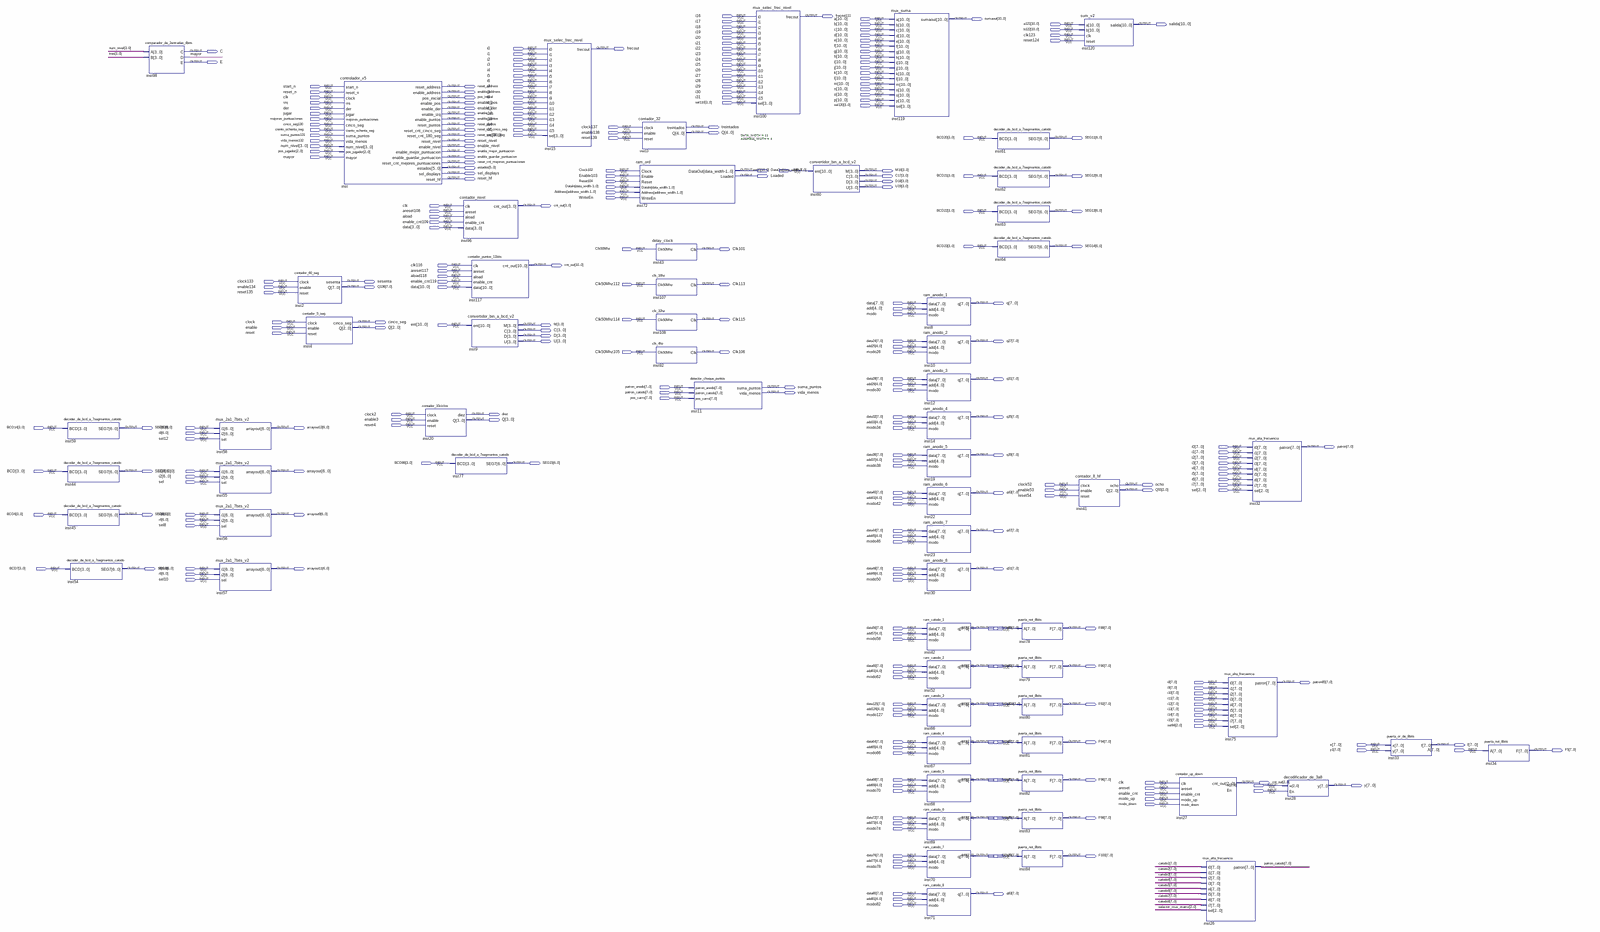
[diagram p0: schematic sheet, whole]
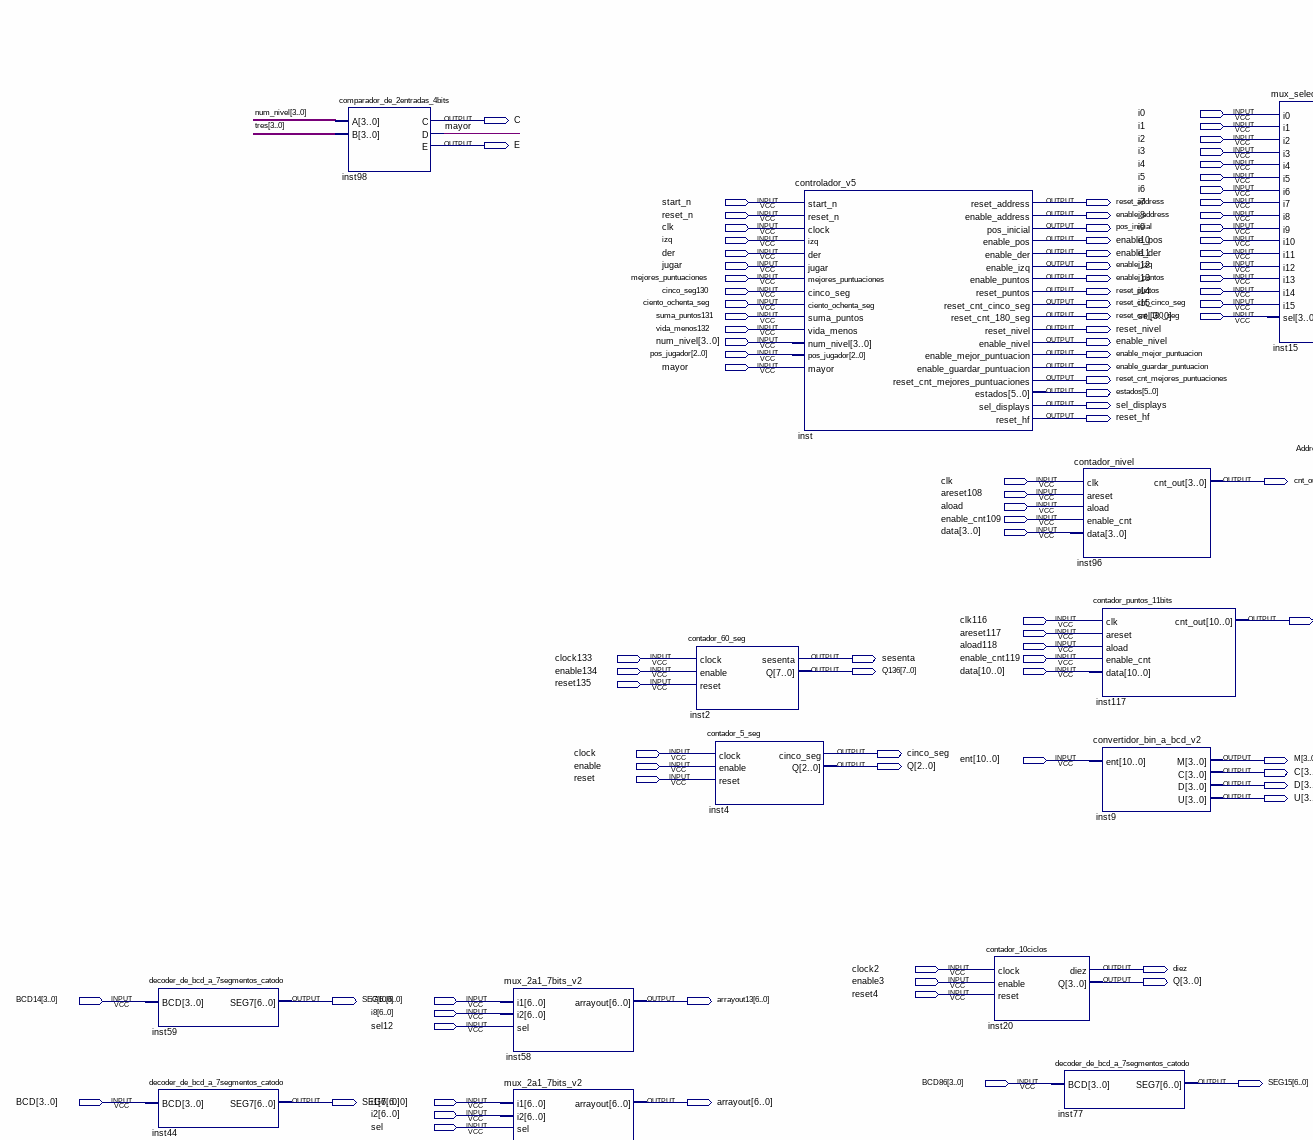
[diagram p1: schematic sheet, upper left part]
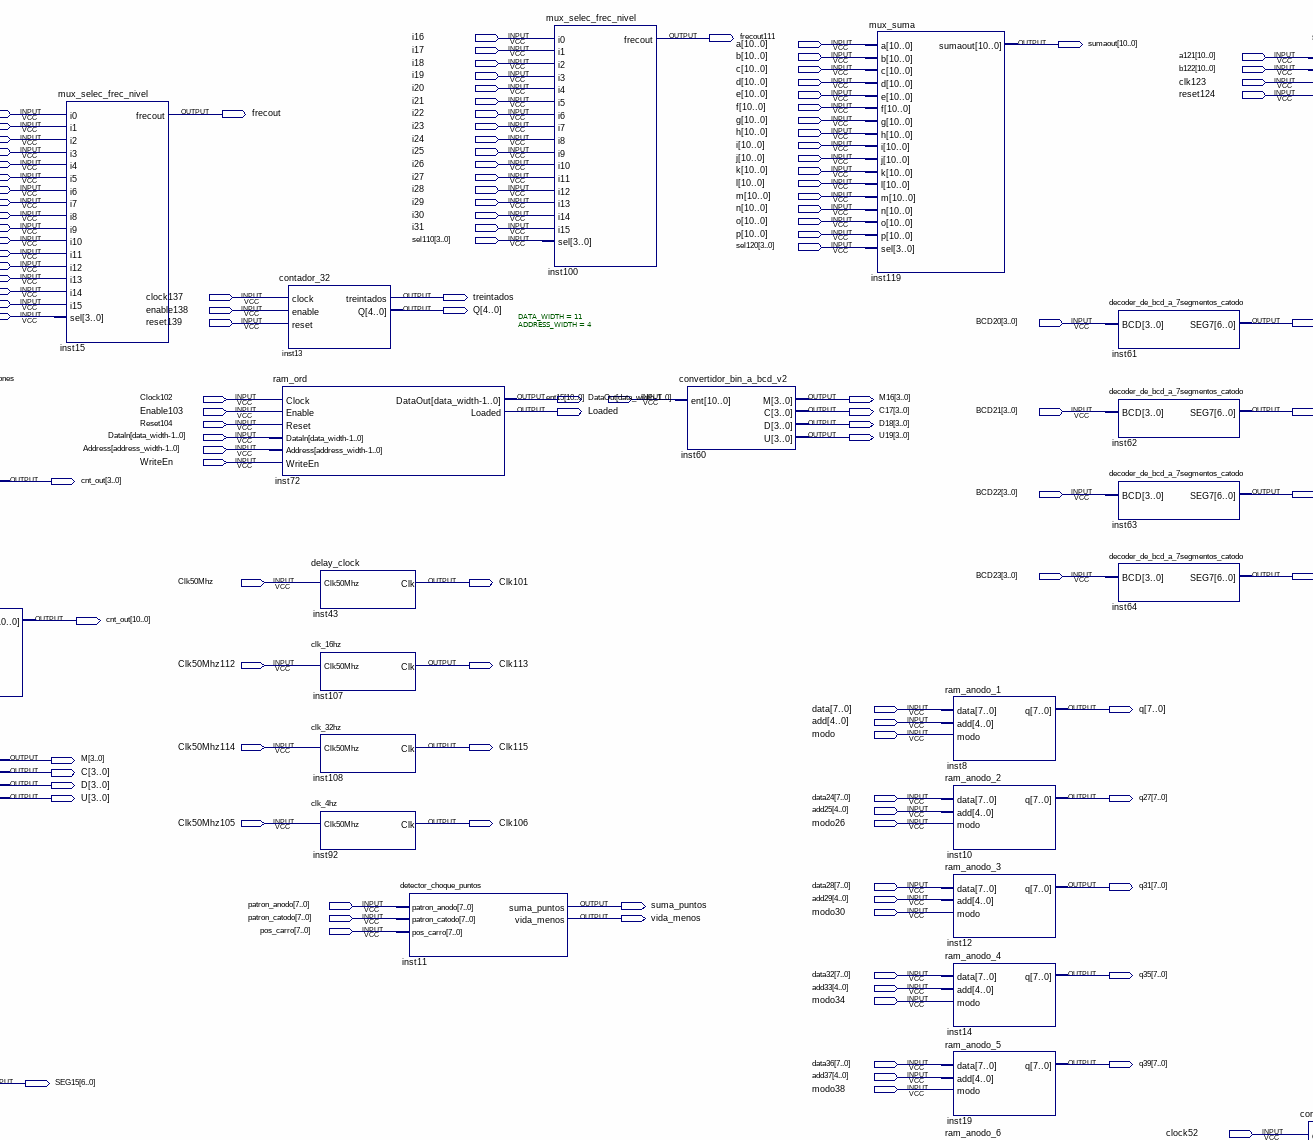
[diagram p2: schematic sheet, upper centre part]
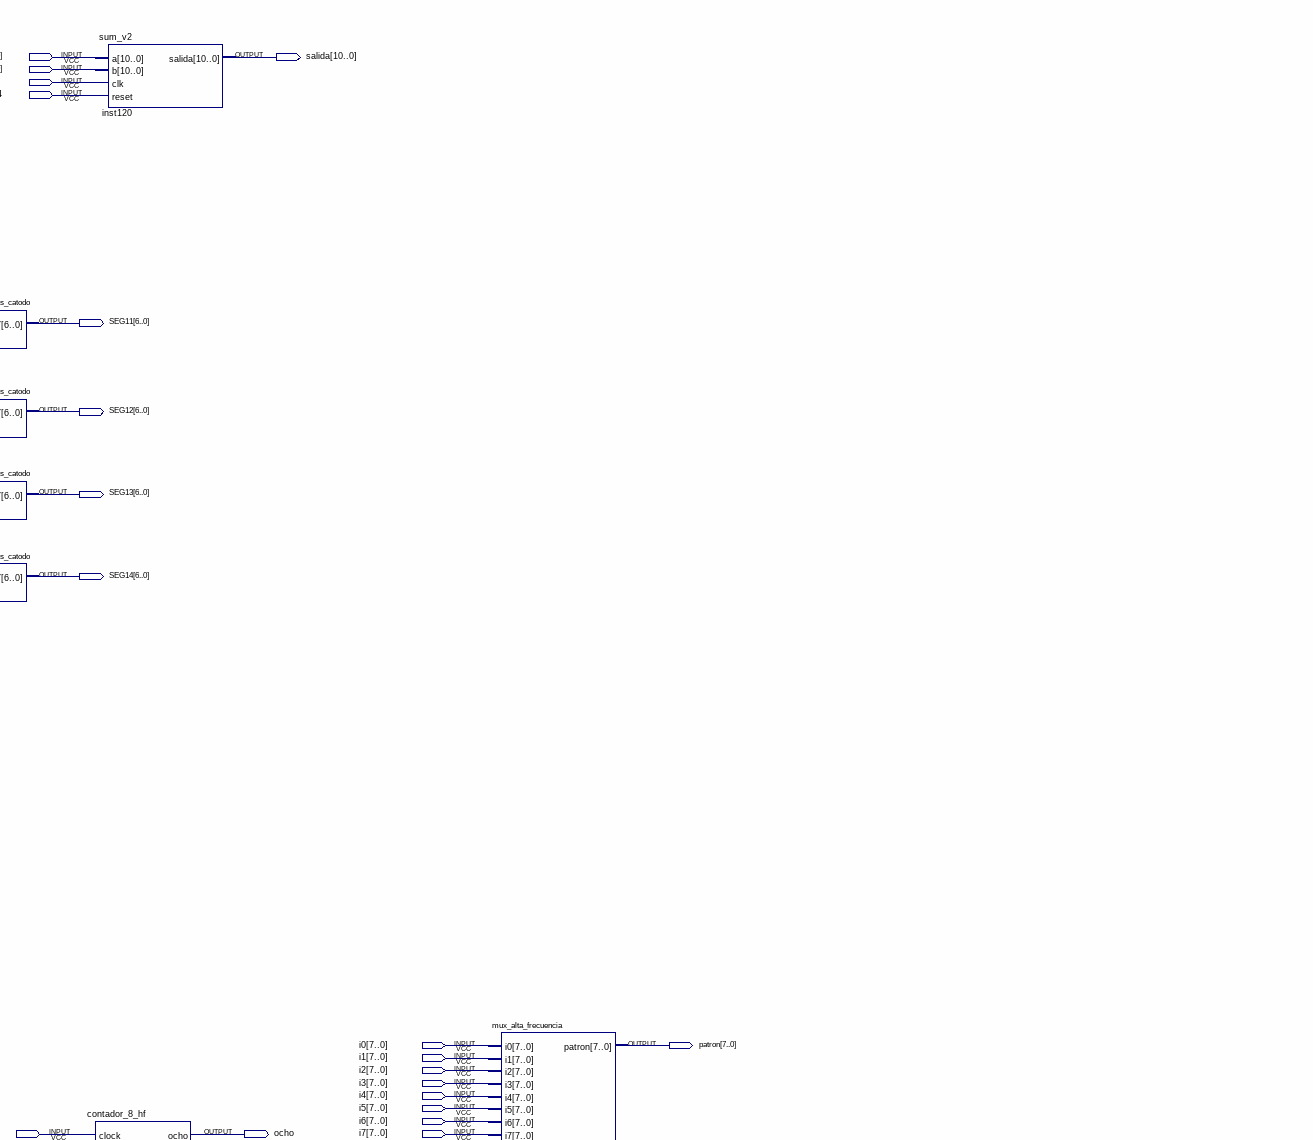
[diagram p3: schematic sheet, upper right part]
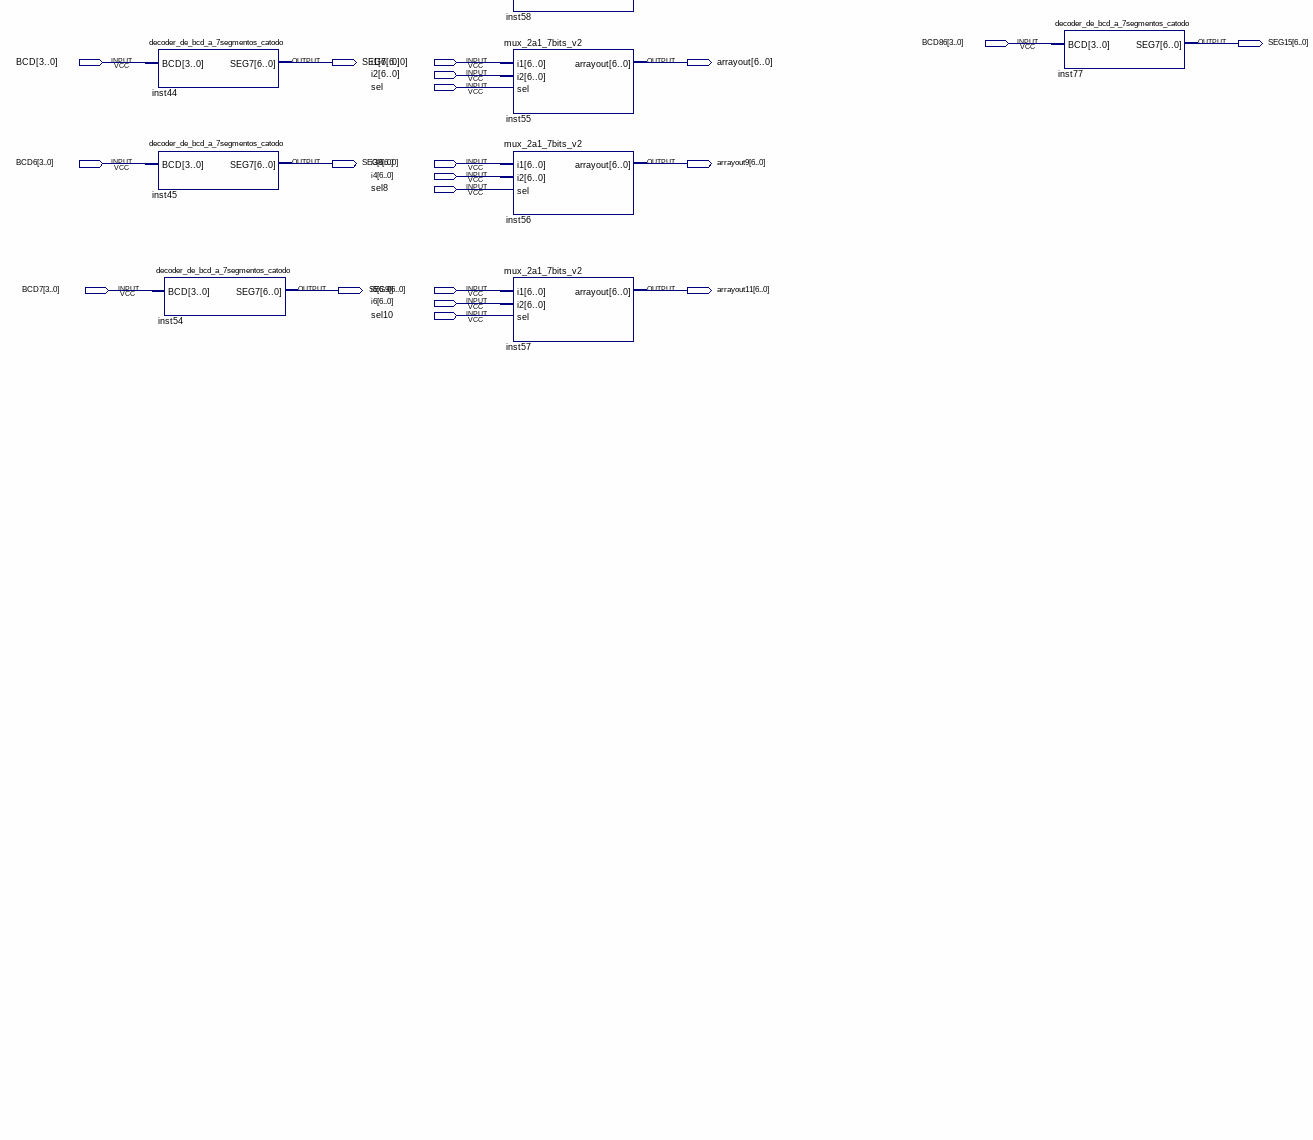
[diagram p4: schematic sheet, lower left part]
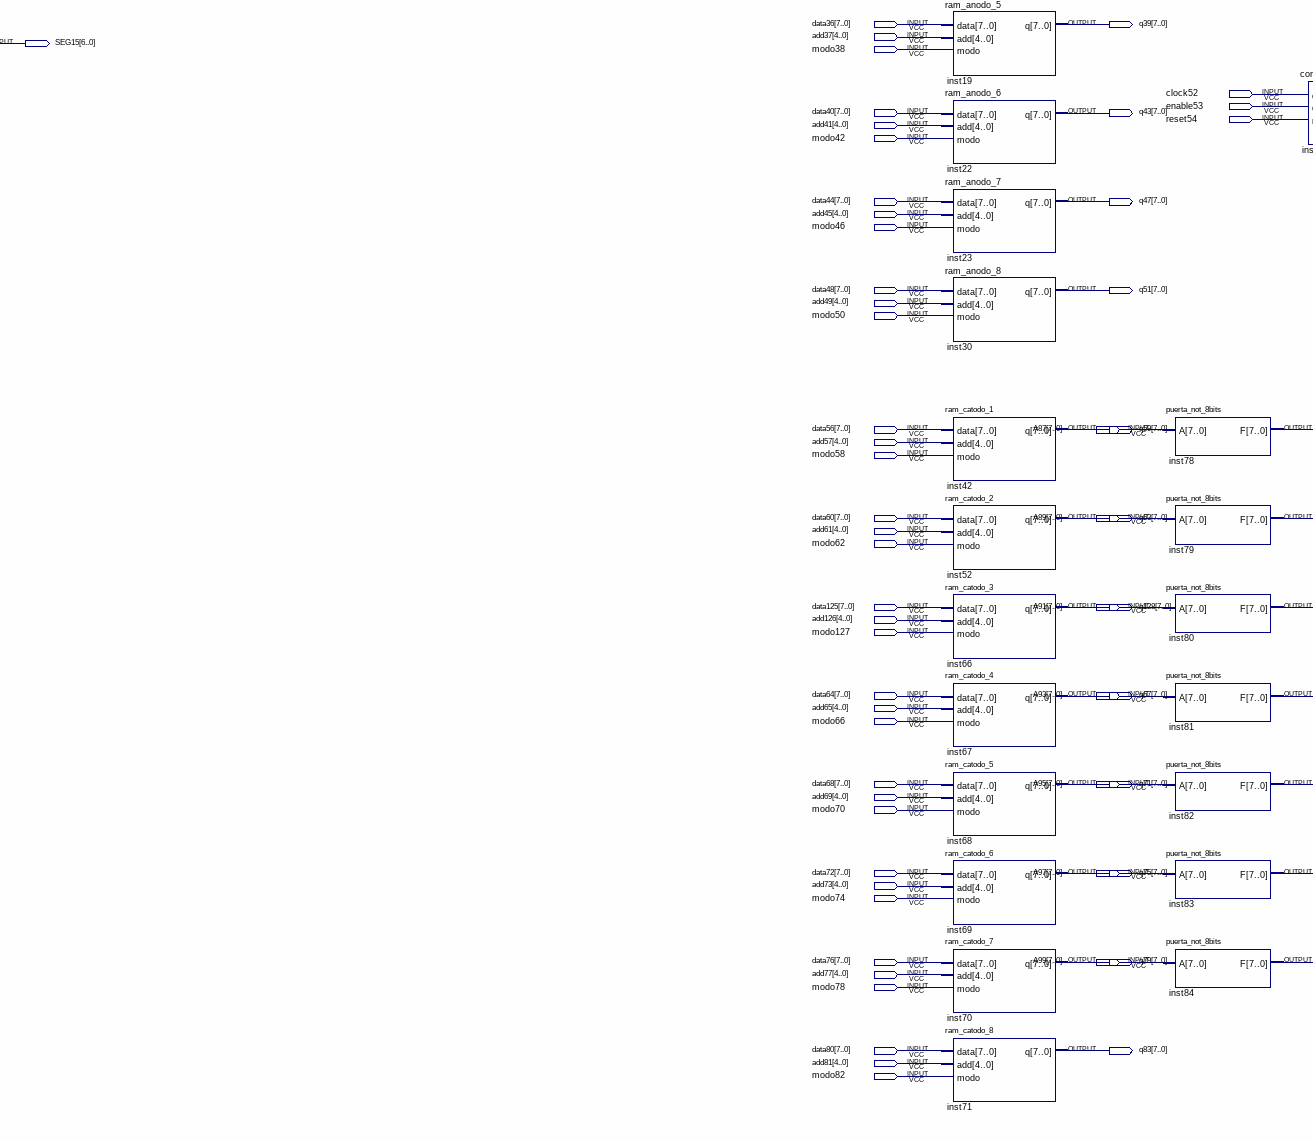
[diagram p5: schematic sheet, lower centre part]
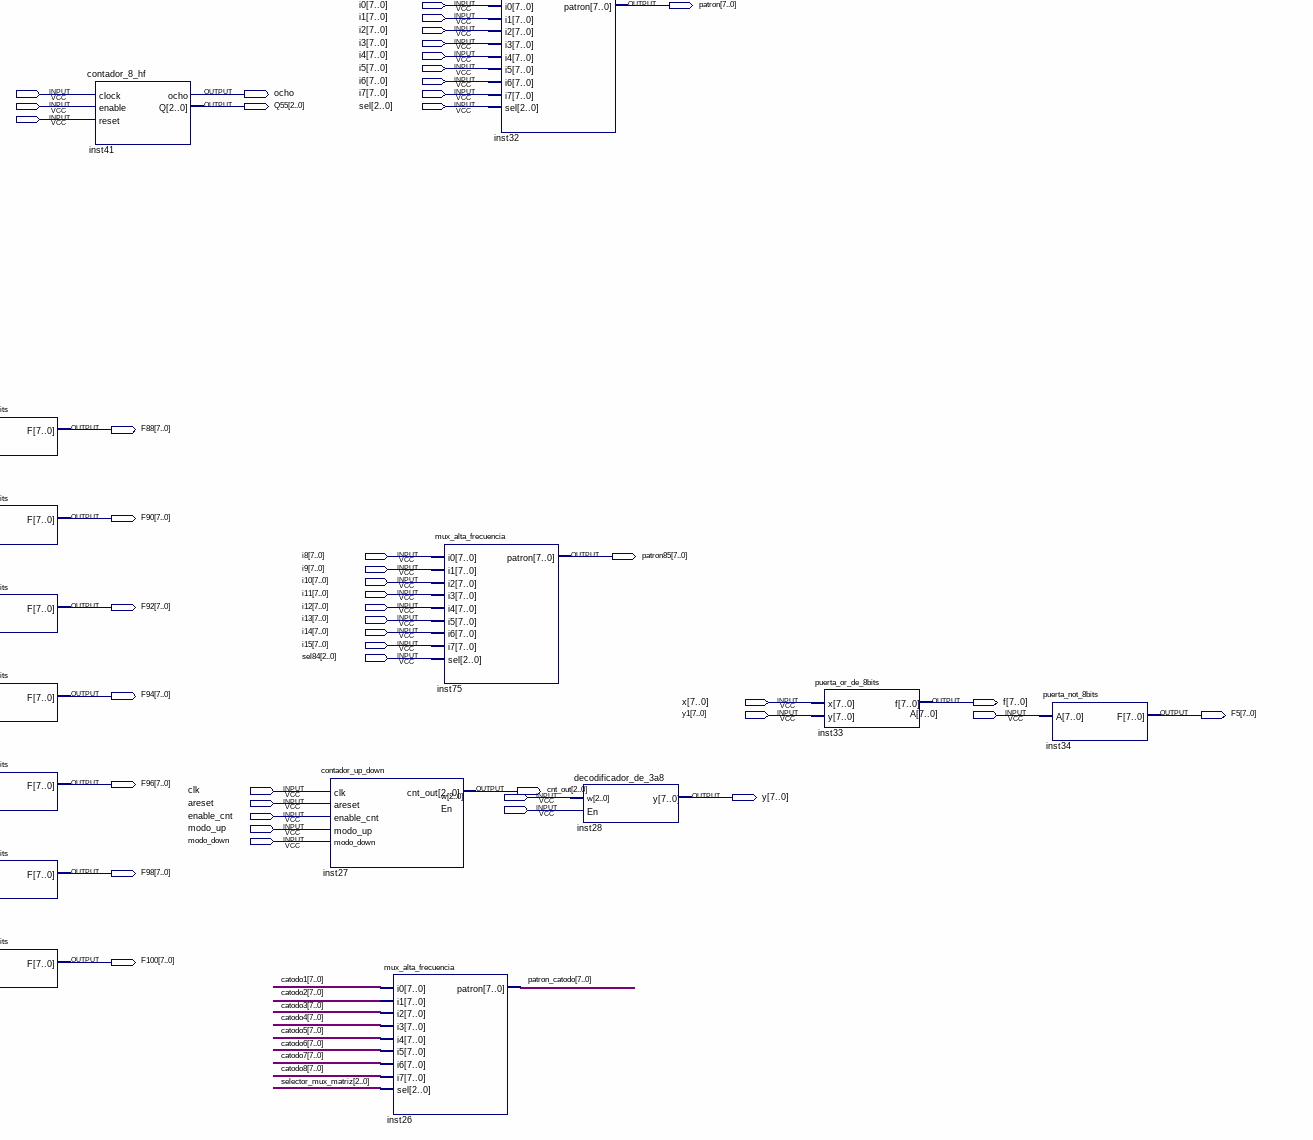
[diagram p6: schematic sheet, lower right part]
// Quartus schematic pruebas.bdf as structural Verilog: 64 symbols, 307 pins
module pruebas (
  input  i16,
  input  [10:0] A,
  input  i17,
  input  [10:0] b,
  input  [10:0] a121,
  input  i18,
  inout  [10:0] c,
  input  [10:0] b122,
  input  i19,
  inout  [10:0] d,
  input  clk123,
  input  i20,
  input  [10:0] e,
  input  reset124,
  input  i21,
  inout  [10:0] f,
  input  i0_1bit,
  input  i22,
  input  [10:0] g,
  input  i1_1bit,
  input  i23,
  input  [10:0] h,
  input  i2_1bit,
  input  i24,
  input  [10:0] i,
  input  i3_1bit,
  input  i25,
  input  [10:0] j,
  input  i4_1bit,
  input  i26,
  input  [10:0] k,
  input  i5_1bit,
  input  i27,
  input  [10:0] l,
  input  i6_1bit,
  input  i28,
  inout  [10:0] m,
  input  start_n,
  input  i7_1bit,
  input  i29,
  input  [10:0] n,
  input  reset_n,
  input  i8_1bit,
  input  i30,
  input  [10:0] o,
  input  clk,
  input  i9_1bit,
  input  i31,
  input  [10:0] p,
  input  izq,
  input  i10_1bit,
  input  [3:0] sel110,
  input  [3:0] sel120,
  input  der,
  input  i11_1bit,
  input  jugar,
  input  i12_1bit,
  input  mejores_puntuaciones,
  input  i13_1bit,
  input  cinco_seg130,
  input  i14_1bit,
  input  clock137,
  input  ciento_ochenta_seg,
  input  i15_1bit,
  input  enable138,
  input  suma_puntos131,
  input  [3:0] sel,
  input  reset139,
  input  [3:0] BCD20,
  input  vida_menos132,
  input  [3:0] num_nivel,
  input  [2:0] pos_jugador,
  input  mayor,
  input  Clock102,
  input  [10:0] ent15,
  input  Enable103,
  input  [3:0] BCD21,
  input  Reset104,
  input  \DataIn[data_width-1..0] ,
  input  \Address[address_width-1..0] ,
  input  WriteEn,
  input  areset108,
  input  [3:0] BCD22,
  input  aload,
  input  enable_cnt109,
  input  [10:0] data,
  input  [3:0] BCD23,
  input  Clk50Mhz,
  input  clk116,
  input  areset117,
  input  aload118,
  input  clock133,
  input  enable_cnt119,
  input  Clk50Mhz112,
  input  enable134,
  input  reset135,
  input  [4:0] add,
  input  modo,
  input  Clk50Mhz114,
  input  clock,
  input  [10:0] ent,
  input  enable,
  input  reset,
  input  [7:0] data24,
  input  [4:0] add25,
  input  Clk50Mhz105,
  input  modo26,
  input  [7:0] data28,
  input  [4:0] add29,
  input  [7:0] patron_anodo,
  input  modo30,
  input  [7:0] patron_catodo,
  input  [7:0] pos_carro,
  input  clock2,
  input  [7:0] data32,
  input  enable3,
  input  [4:0] add33,
  input  reset4,
  input  [3:0] BCD14,
  input  [7:0] i7,
  input  modo34,
  input  [7:0] i8,
  input  sel12,
  input  [7:0] i0,
  input  [7:0] i1,
  input  [7:0] data36,
  input  [7:0] i2,
  input  [4:0] add37,
  input  [3:0] BCD86,
  input  [7:0] i3,
  input  modo38,
  input  [7:0] i4,
  input  [3:0] BCD,
  input  [7:0] i5,
  input  [7:0] i6,
  input  sel_1bit,
  input  clock52,
  input  enable53,
  input  [7:0] data40,
  input  reset54,
  input  [4:0] add41,
  input  modo42,
  input  [3:0] BCD6,
  input  sel8,
  input  [7:0] data44,
  input  [4:0] add45,
  input  modo46,
  input  [3:0] BCD7,
  input  [7:0] data48,
  input  [4:0] add49,
  input  sel10,
  input  modo50,
  input  [7:0] data56,
  input  [7:0] A87,
  input  [4:0] add57,
  input  modo58,
  input  [7:0] data60,
  input  [7:0] A89,
  input  [4:0] add61,
  input  modo62,
  input  [7:0] i9,
  input  [7:0] i10,
  input  [7:0] i11,
  input  [7:0] data125,
  input  [7:0] A91,
  input  [7:0] i12,
  input  [4:0] add126,
  input  [7:0] i13,
  input  modo127,
  input  [7:0] i14,
  input  [7:0] i15,
  input  [2:0] sel84,
  input  [7:0] data64,
  input  [7:0] A93,
  input  [7:0] x,
  input  [4:0] add65,
  input  [7:0] y1,
  input  modo66,
  input  [7:0] data68,
  input  [7:0] A95,
  input  [4:0] add69,
  input  [2:0] w,
  input  areset,
  input  modo70,
  input  En,
  input  enable_cnt,
  input  modo_up,
  input  modo_down,
  input  [7:0] data72,
  input  [7:0] A97,
  input  [4:0] add73,
  input  modo74,
  input  [7:0] data76,
  input  [7:0] A99,
  input  [4:0] add77,
  input  modo78,
  input  [7:0] data80,
  input  [4:0] add81,
  input  modo82,
  output frecout111,
  output [10:0] sumaout,
  output [10:0] salida,
  output frecout,
  output c_1bit,
  output e_1bit,
  output reset_address,
  output enable_address,
  output pos_inicial,
  output enable_pos,
  output enable_der,
  output enable_izq,
  output enable_puntos,
  output reset_puntos,
  output treintados,
  output reset_cnt_cinco_seg,
  output [7:0] Q,
  output reset_cnt_180_seg,
  output [6:0] SEG11,
  output reset_nivel,
  output enable_nivel,
  output enable_mejor_puntuacion,
  output enable_guardar_puntuacion,
  output reset_cnt_mejores_puntuaciones,
  output [5:0] estados,
  output \DataOut[data_width-1..0] ,
  output [3:0] M16,
  output sel_displays,
  output Loaded,
  output [3:0] C17,
  output [6:0] SEG12,
  output reset_hf,
  output [3:0] D18,
  output [3:0] U19,
  output [10:0] cnt_out,
  output [6:0] SEG13,
  output [6:0] SEG14,
  output Clk101,
  output sesenta,
  output Clk113,
  output [7:0] Q136,
  output Clk115,
  output cinco_seg,
  output [3:0] U,
  output [7:0] q27,
  output Clk106,
  output [7:0] q31,
  output suma_puntos,
  output vida_menos,
  output diez,
  output [7:0] q35,
  output [6:0] SEG10,
  output [6:0] arrayout13,
  output [7:0] patron,
  output [7:0] q39,
  output [6:0] SEG15,
  output [6:0] SEG7,
  output [6:0] arrayout,
  output ocho,
  output [2:0] Q55,
  output [7:0] q43,
  output [6:0] SEG8,
  output [6:0] arrayout9,
  output [7:0] q47,
  output [6:0] SEG9,
  output [6:0] arrayout11,
  output [7:0] q51,
  output [7:0] q59,
  output [7:0] F88,
  output [7:0] q63,
  output [7:0] F90,
  output [7:0] patron85,
  output [7:0] q128,
  output [7:0] F92,
  output [7:0] q67,
  output [7:0] F94,
  output [7:0] F5,
  output [7:0] q71,
  output [7:0] F96,
  output [7:0] y,
  output [7:0] q75,
  output [7:0] F98,
  output [7:0] q79,
  output [7:0] F100,
  output [7:0] q83
);

  wire [2:0] selector_mux_matriz;
  wire [3:0] tres;
  wire [7:0] catodo1, catodo2, catodo3, catodo4, catodo5, catodo6, catodo7, catodo8;

  decoder_de_bcd_a_7segmentos_catodo inst59 (.BCD(BCD14), .SEG7(SEG10));
  decoder_de_bcd_a_7segmentos_catodo inst44 (.BCD(BCD), .SEG7(SEG7));
  decoder_de_bcd_a_7segmentos_catodo inst45 (.BCD(BCD6), .SEG7(SEG8));
  decoder_de_bcd_a_7segmentos_catodo inst54 (.BCD(BCD7), .SEG7(SEG9));
  comparador_de_2entradas_4bits inst98 (.A(num_nivel), .B(tres), .C(c_1bit), .D(mayor), .E(e_1bit));
  mux_2a1_7bits_v2 inst58 (.i1(i7[6:0]), .i2(i8[6:0]), .sel(sel12), .arrayout(arrayout13));
  mux_2a1_7bits_v2 inst55 (.i1(i1[6:0]), .i2(i2[6:0]), .sel(sel_1bit), .arrayout(arrayout));
  mux_2a1_7bits_v2 inst56 (.i1(i3[6:0]), .i2(i4[6:0]), .sel(sel8), .arrayout(arrayout9));
  mux_2a1_7bits_v2 inst57 (.i1(i5[6:0]), .i2(i6[6:0]), .sel(sel10), .arrayout(arrayout11));
  contador_60_seg inst2 (.clock(clock133), .enable(enable134), .reset(reset135), .sesenta(sesenta), .Q(Q136));
  contador_5_seg inst4 (.clock(clock), .enable(enable), .reset(reset), .cinco_seg(cinco_seg), .Q(Q[2:0]));
  controlador_v5 inst (
    .start_n(start_n), .reset_n(reset_n), .clock(clk), .izq(izq), .der(der), .jugar(jugar),
    .mejores_puntuaciones(mejores_puntuaciones), .cinco_seg(cinco_seg130),
    .ciento_ochenta_seg(ciento_ochenta_seg), .suma_puntos(suma_puntos131), .vida_menos(vida_menos132),
    .num_nivel(num_nivel), .pos_jugador(pos_jugador), .mayor(mayor), .reset_address(reset_address),
    .enable_address(enable_address), .pos_inicial(pos_inicial), .enable_pos(enable_pos),
    .enable_der(enable_der), .enable_izq(enable_izq), .enable_puntos(enable_puntos),
    .reset_puntos(reset_puntos), .reset_cnt_cinco_seg(reset_cnt_cinco_seg),
    .reset_cnt_180_seg(reset_cnt_180_seg), .reset_nivel(reset_nivel), .enable_nivel(enable_nivel),
    .enable_mejor_puntuacion(enable_mejor_puntuacion), .enable_guardar_puntuacion(enable_guardar_puntuacion),
    .reset_cnt_mejores_puntuaciones(reset_cnt_mejores_puntuaciones), .estados(estados),
    .sel_displays(sel_displays), .reset_hf(reset_hf));
  contador_10ciclos inst20 (.clock(clock2), .enable(enable3), .reset(reset4), .diez(diez), .Q(Q[3:0]));
  contador_nivel inst96 (
    .clk(clk), .areset(areset108), .aload(aload), .enable_cnt(enable_cnt109), .data(data[3:0]),
    .cnt_out(cnt_out[3:0]));
  contador_puntos_11bits inst117 (
    .clk(clk116), .areset(areset117), .aload(aload118), .enable_cnt(enable_cnt119), .data(data),
    .cnt_out(cnt_out));
  convertidor_bin_a_bcd_v2 inst9 (.ent(ent), .M(m[3:0]), .C(c[3:0]), .D(d[3:0]), .U(U));
  decoder_de_bcd_a_7segmentos_catodo inst77 (.BCD(BCD86), .SEG7(SEG15));
  mux_selec_frec_nivel inst15 (
    .i0(i0_1bit), .i1(i1_1bit), .i2(i2_1bit), .i3(i3_1bit), .i4(i4_1bit), .i5(i5_1bit), .i6(i6_1bit),
    .i7(i7_1bit), .i8(i8_1bit), .i9(i9_1bit), .i10(i10_1bit), .i11(i11_1bit), .i12(i12_1bit), .i13(i13_1bit),
    .i14(i14_1bit), .i15(i15_1bit), .sel(sel), .frecout(frecout));
  contador_32 inst13 (.clock(clock137), .enable(enable138), .reset(reset139), .treintados(treintados), .Q(Q[4:0]));
  ram_ord #(.DATA_WIDTH(11), .ADDRESS_WIDTH(4)) inst72 (
    .Clock(Clock102), .Enable(Enable103), .Reset(Reset104), .DataIn({11{\DataIn[data_width-1..0] }}),
    .Address({4{\Address[address_width-1..0] }}), .WriteEn(WriteEn), .DataOut(\DataOut[data_width-1..0] ),
    .Loaded(Loaded));
  delay_clock inst43 (.Clk50Mhz(Clk50Mhz), .Clk(Clk101));
  clk_16hz inst107 (.Clk50Mhz(Clk50Mhz112), .Clk(Clk113));
  clk_32hz inst108 (.Clk50Mhz(Clk50Mhz114), .Clk(Clk115));
  clk_4hz inst92 (.Clk50Mhz(Clk50Mhz105), .Clk(Clk106));
  detector_choque_puntos inst11 (
    .patron_anodo(patron_anodo), .patron_catodo(patron_catodo), .pos_carro(pos_carro),
    .suma_puntos(suma_puntos), .vida_menos(vida_menos));
  mux_selec_frec_nivel inst100 (
    .i0(i16), .i1(i17), .i2(i18), .i3(i19), .i4(i20), .i5(i21), .i6(i22), .i7(i23), .i8(i24), .i9(i25),
    .i10(i26), .i11(i27), .i12(i28), .i13(i29), .i14(i30), .i15(i31), .sel(sel110), .frecout(frecout111));
  convertidor_bin_a_bcd_v2 inst60 (.ent(ent15), .M(M16), .C(C17), .D(D18), .U(U19));
  mux_suma inst119 (
    .a(A), .b(b), .c(c), .d(d), .e(e), .f(f), .g(g), .h(h), .i(i), .j(j), .k(k), .l(l), .m(m), .n(n), .o(o),
    .p(p), .sel(sel120), .sumaout(sumaout));
  ram_anodo_1 inst8 (.data(data[7:0]), .add(add), .modo(modo), .q(Q));
  ram_anodo_2 inst10 (.data(data24), .add(add25), .modo(modo26), .q(q27));
  ram_anodo_3 inst12 (.data(data28), .add(add29), .modo(modo30), .q(q31));
  ram_anodo_4 inst14 (.data(data32), .add(add33), .modo(modo34), .q(q35));
  ram_anodo_5 inst19 (.data(data36), .add(add37), .modo(modo38), .q(q39));
  ram_anodo_6 inst22 (.data(data40), .add(add41), .modo(modo42), .q(q43));
  ram_anodo_7 inst23 (.data(data44), .add(add45), .modo(modo46), .q(q47));
  ram_anodo_8 inst30 (.data(data48), .add(add49), .modo(modo50), .q(q51));
  ram_catodo_1 inst42 (.data(data56), .add(add57), .modo(modo58), .q(q59));
  ram_catodo_2 inst52 (.data(data60), .add(add61), .modo(modo62), .q(q63));
  ram_catodo_3 inst66 (.data(data125), .add(add126), .modo(modo127), .q(q128));
  ram_catodo_4 inst67 (.data(data64), .add(add65), .modo(modo66), .q(q67));
  ram_catodo_5 inst68 (.data(data68), .add(add69), .modo(modo70), .q(q71));
  ram_catodo_6 inst69 (.data(data72), .add(add73), .modo(modo74), .q(q75));
  ram_catodo_7 inst70 (.data(data76), .add(add77), .modo(modo78), .q(q79));
  ram_catodo_8 inst71 (.data(data80), .add(add81), .modo(modo82), .q(q83));
  decoder_de_bcd_a_7segmentos_catodo inst61 (.BCD(BCD20), .SEG7(SEG11));
  decoder_de_bcd_a_7segmentos_catodo inst62 (.BCD(BCD21), .SEG7(SEG12));
  decoder_de_bcd_a_7segmentos_catodo inst63 (.BCD(BCD22), .SEG7(SEG13));
  decoder_de_bcd_a_7segmentos_catodo inst64 (.BCD(BCD23), .SEG7(SEG14));
  puerta_not_8bits inst78 (.A(A87), .F(F88));
  puerta_not_8bits inst79 (.A(A89), .F(F90));
  puerta_not_8bits inst80 (.A(A91), .F(F92));
  puerta_not_8bits inst81 (.A(A93), .F(F94));
  puerta_not_8bits inst82 (.A(A95), .F(F96));
  puerta_not_8bits inst83 (.A(A97), .F(F98));
  puerta_not_8bits inst84 (.A(A99), .F(F100));
  contador_8_hf inst41 (.clock(clock52), .enable(enable53), .reset(reset54), .ocho(ocho), .Q(Q55));
  sum_v2 inst120 (.a(a121), .b(b122), .clk(clk123), .reset(reset124), .salida(salida));
  contador_up_down inst27 (
    .clk(clk), .areset(areset), .enable_cnt(enable_cnt), .modo_up(modo_up), .modo_down(modo_down),
    .cnt_out(cnt_out[2:0]));
  mux_alta_frecuencia inst26 (
    .i0(catodo1), .i1(catodo2), .i2(catodo3), .i3(catodo4), .i4(catodo5), .i5(catodo6), .i6(catodo7),
    .i7(catodo8), .sel(selector_mux_matriz), .patron(patron_catodo));
  mux_alta_frecuencia inst75 (
    .i0(i8), .i1(i9), .i2(i10), .i3(i11), .i4(i12), .i5(i13), .i6(i14), .i7(i15), .sel(sel84),
    .patron(patron85));
  mux_alta_frecuencia inst32 (
    .i0(i0), .i1(i1), .i2(i2), .i3(i3), .i4(i4), .i5(i5), .i6(i6), .i7(i7), .sel(sel[2:0]), .patron(patron));
  decodificador_de_3a8 inst28 (.w(w), .En(En), .y(y));
  puerta_or_de_8bits inst33 (.x(x), .y(y1), .f(f[7:0]));
  puerta_not_8bits inst34 (.A(A[7:0]), .F(F5));
endmodule
